# Altium schematic sheet BYPASS_BLOCK.SchDoc
size A4; SheetNumber: 6; SheetTotal: 7
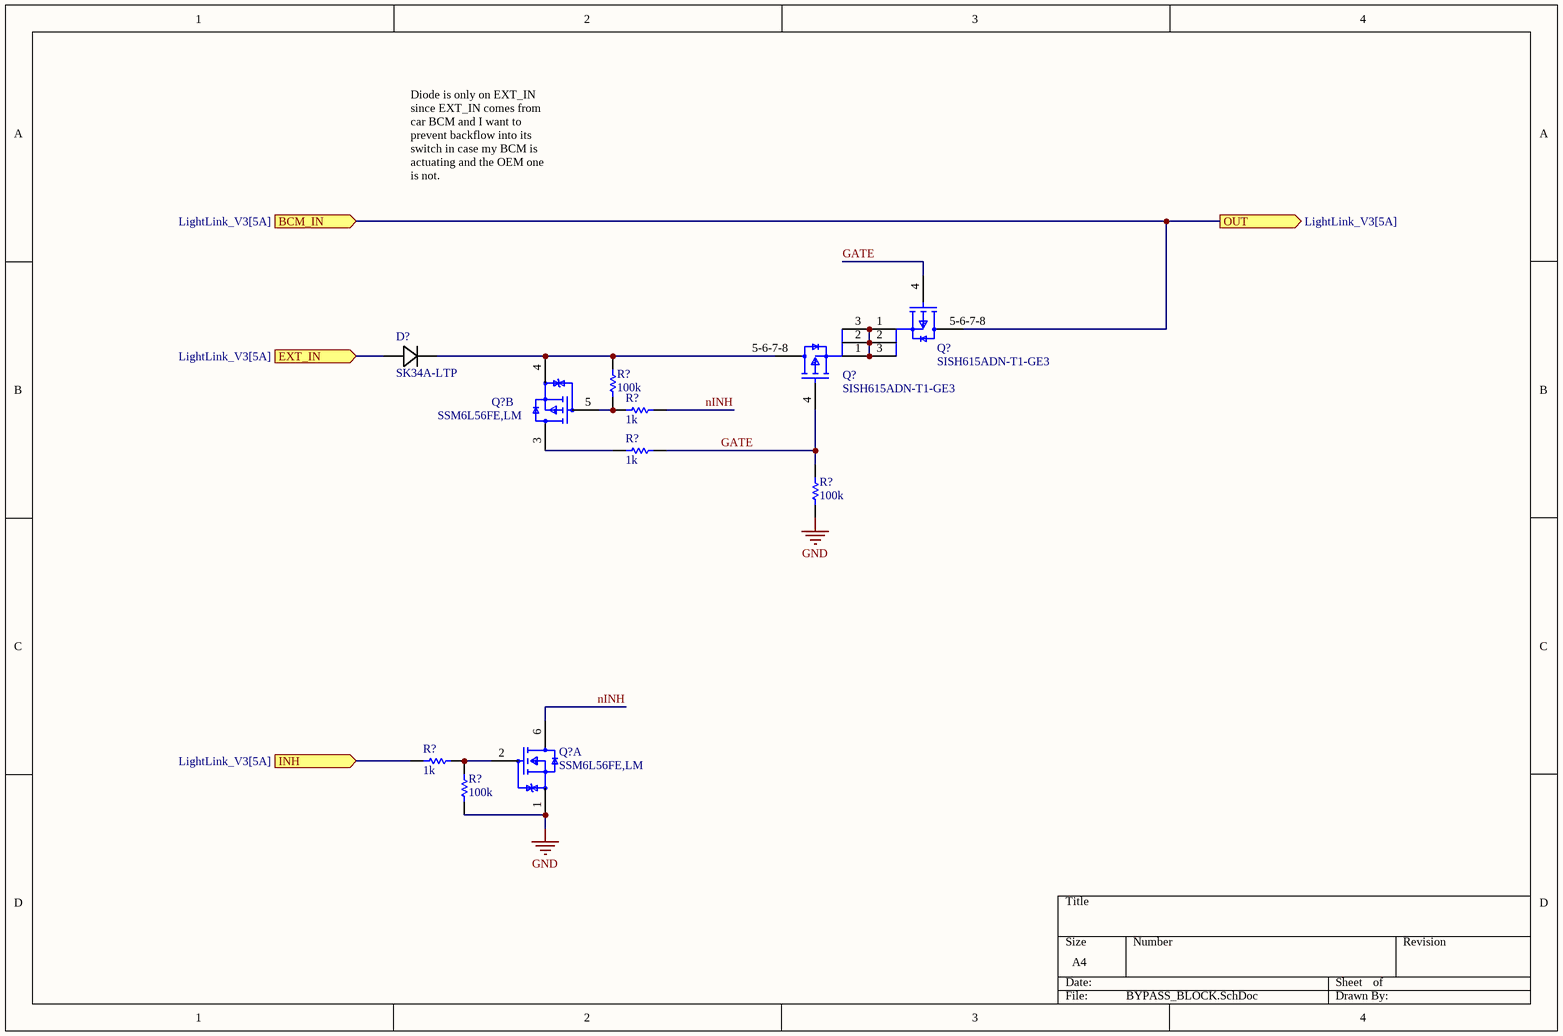
[diagram p0: BYPASS_BLOCK.SchDoc]

## Parts
(Parts that share a designator on the sheet are numbered #1, #2 ... from top to bottom, then left to right.)
D?  SK34A-LTP  [SK34A-LTP-Footprint-1]
Q?#1  SISH615ADN-T1-GE3  [SISH615ADN-T1-GE3-Footprint-1]
Q?#2  SSM6L56FE,LM  [FP-SON6-P-0_50-MFG]  (part B of 2)
Q?#3  SISH615ADN-T1-GE3  [SISH615ADN-T1-GE3-Footprint-1]
Q?#4  SSM6L56FE,LM  [FP-SON6-P-0_50-MFG]  (part A of 2)
R?#1  100k  [R0603B]
R?#2  1k  [R0603B]
R?#3  1k  [R0603B]
R?#4  100k  [R0603B]
R?#5  1k  [R0603B]
R?#6  100k  [R0603B]

## Ports
BCM_IN (in, see LightLink_V3[5A]), EXT_IN (in, see LightLink_V3[5A]), INH (in, see LightLink_V3[5A]), OUT (out, see LightLink_V3[5A])

## Nets
GND: Q?#4.1(Source_1) R?#4.2 R?#6.1
BCM_IN: Q?#1.5-6-7-8(D) ; port OUT, port BCM_IN
EXT_IN: D?.2(ANODE) ; port EXT_IN
GATE: Q?#1.4(G) Q?#3.4(G) R?#3.2 R?#4.1
INH: R?#5.2 ; port INH
nINH: Q?#4.6(Drain_1) R?#2.2
NetD?_1: D?.1(CATHODE) Q?#2.4(Source_2) Q?#3.5-6-7-8(D) R?#1.1
NetQ?#1_1: Q?#1.1(S) Q?#1.2(S) Q?#1.3(S) Q?#3.1(S) Q?#3.2(S) Q?#3.3(S)
NetQ?#2_3: Q?#2.3(Drain_2) R?#3.1
NetQ?#2_5: Q?#2.5(Gate_2) R?#1.2 R?#2.1
NetQ?#4_2: Q?#4.2(Gate_1) R?#5.1 R?#6.2

## Notes on the sheet
- Diode is only on EXT_IN since EXT_IN comes from car BCM and I want to prevent backflow into its switch in case my BCM is actuating and the OEM one is not.

## Library data of the parts
D? = CMP-004-00058-2: Rectifier Diode, Schottky, 1 Phase, 1 Element, 3A, 40V V(RRM), Silicon, DO-214AC; Forward Voltage: 500mV; Max Operating Temperature: 125°C; Pins: 2; RoHS Compliant: Yes
Q?#1 Q?#3 = CMP-013-00018-2: Trans MOSFET P-CH 20V 22.1A 8-Pin PowerPAK 1212 EP T/R; Source: SISH615ADN-T1-GE3.SchLib; Design Item ID: CMP-013-00036-4; Component Type: Standard; Pins: 5
Q?#2 Q?#4 = CMP-35916-000023-1: SMALL-SIGNAL MOSFET 2 IN 1 NCH +
R?#1-R?#6 = CMP-009-00002-14: Resistor
  R?#1 R?#4 R?#6: Value: 100k
  R?#2 R?#3 R?#5: Value: 1k